# EAGLE design creebreakout (EAGLE 5.10)
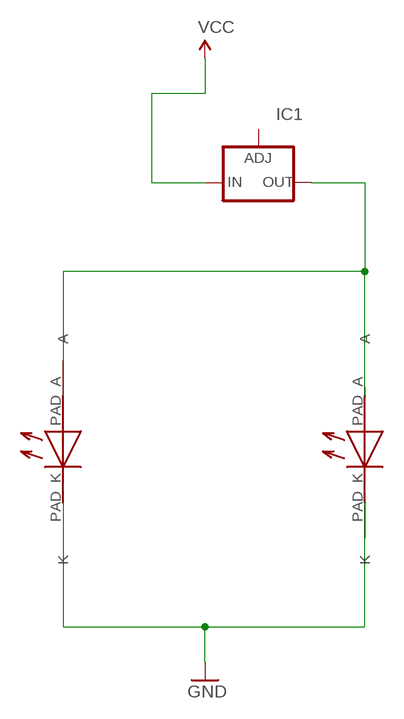
[diagram p0: schematic, sheet 1]

## Parts
IC1  LM337TL  [337TL]
U$1  CREE_SMD_7X9  [CREE_7X9]
U$2  CREE_SMD_7X9  [CREE_7X9]

## Nets
GND: U$1.PAD_K(K) U$2.PAD_K(K)
N$2: IC1.3(OUT) U$1.PAD_A(A) U$2.PAD_A(A)
VCC: IC1.2(IN)
Unconnected: IC1.1(ADJ)

## Library data of the parts
IC1 = v-reg:LM337TL: VOLTAGE REGULATOR
U$1 U$2 = led_cree_7x9:CREE_SMD_7X9: Cree SMD Highpow-Led Gehäuse 7mm*9mm

## Board
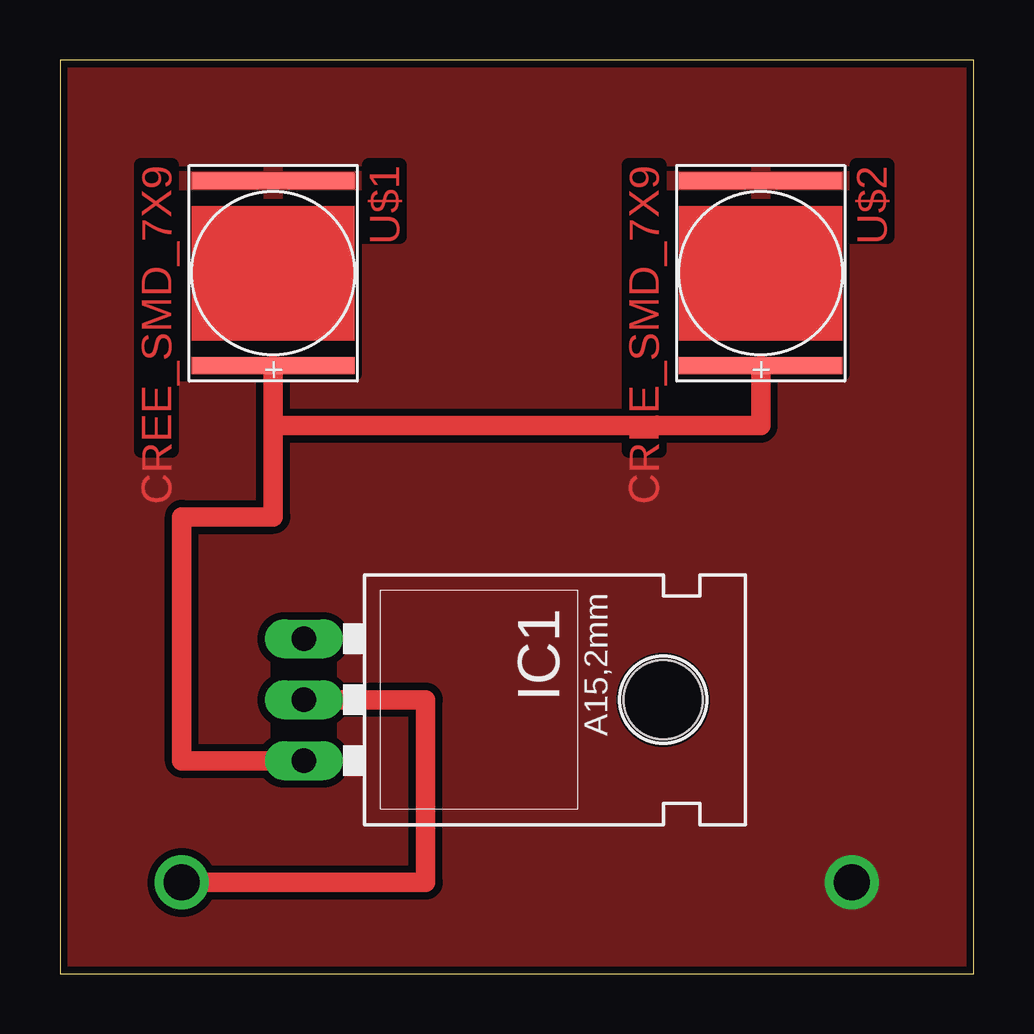
[diagram p1: board, top side]

Size 38.1 x 38.1 mm. Coordinates in mm from the lower left corner, seen from the top.
Outline: 0,0 38.1,0 38.1,38.1 0,38.1 0,0
Copper layers (1*16): Top 0.0356mm / dielectric 1.5011mm / Bottom 0.0356mm
Design rules "SparkFun-mod": minimum track width 8mil, minimum drill 20mil, track to track 12mil, track to pad 12mil, pad to pad 8mil, via to via 8mil, smd to smd 8mil, copper to edge 12mil, drill to drill 8mil, minimum pad ring 12mil, minimum via ring 10mil, stop-mask expansion 4mil, vias tented up to drill 25mil, thermal gap 10mil

### Footprints (pad centres in the part's own frame; a part is rotated, then mirrored left to right if it is on the bottom)
337TL = drill 1.016 long: 1 -2.54,-3.81; 2 0,-3.81; 3 2.54,-3.81 | hole 3.302: 0,11.176
CREE_7X9 = smd 0.7 x 6.8: PAD_A 3.85,0; PAD_K -3.85,0

### Placement (x,y rotation side)
IC1  13.97,11.43 270 top
U$1  8.89,29.21 270 top
U$2  29.21,29.21 270 top

### Tracks (layer width: path | path; a pad name or v marks a point on that pad's centre or on a via)
GND  (via drill 1.5)
  other vias: 33.02,3.81
  pour Top: 0,38.1 38.1,38.1 38.1,27.94 38.1,0 0,0
N$2
  Top 0.813: IC1.3 5.08,8.89 5.08,19.05 8.89,19.05 8.89,22.86 | 8.89,22.86 U$1.PAD_A | 8.89,22.86 29.21,22.86 U$2.PAD_A
VCC  (via drill 1.5)
  Top 0.813: v5.08,3.81 15.24,3.81 15.24,11.43 IC1.2